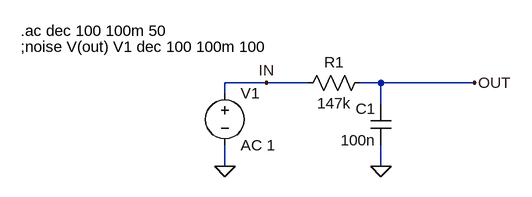
[diagram p0: schematic Draft1.asc]
Draft1.asc, the LTspice schematic file:
Version 4
SHEET 1 880 680
WIRE 32 128 -32 128
WIRE 96 128 32 128
WIRE 208 128 176 128
WIRE 352 128 208 128
WIRE -32 144 -32 128
WIRE 208 160 208 128
WIRE -32 256 -32 224
WIRE 208 256 208 224
FLAG 208 256 0
FLAG -32 256 0
FLAG 352 128 OUT
FLAG 32 128 IN
SYMBOL res 192 112 R90
WINDOW 0 0 56 VBottom 2
WINDOW 3 32 56 VTop 2
SYMATTR InstName R1
SYMATTR Value 147k
SYMBOL cap 224 224 R180
WINDOW 0 24 56 Left 2
WINDOW 3 24 8 Left 2
SYMATTR InstName C1
SYMATTR Value 100n
SYMBOL voltage -32 128 R0
WINDOW 123 0 0 Left 0
WINDOW 39 0 0 Left 0
SYMATTR InstName V1
SYMATTR Value AC 1
TEXT -346 48 Left 2 !.ac dec 100 100m 50
TEXT -346 72 Left 2 !;noise V(out) V1 dec 100 100m 100

The netlist it stands for:
* Draft1.asc
R1 OUT IN 147k
C1 0 OUT 100n
V1 IN 0 AC 1
.ac dec 100 100m 50
;noise V(out) V1 dec 100 100m 100
.backanno
.end

* Results of the author's LTspice run, read from the files saved beside the schematic
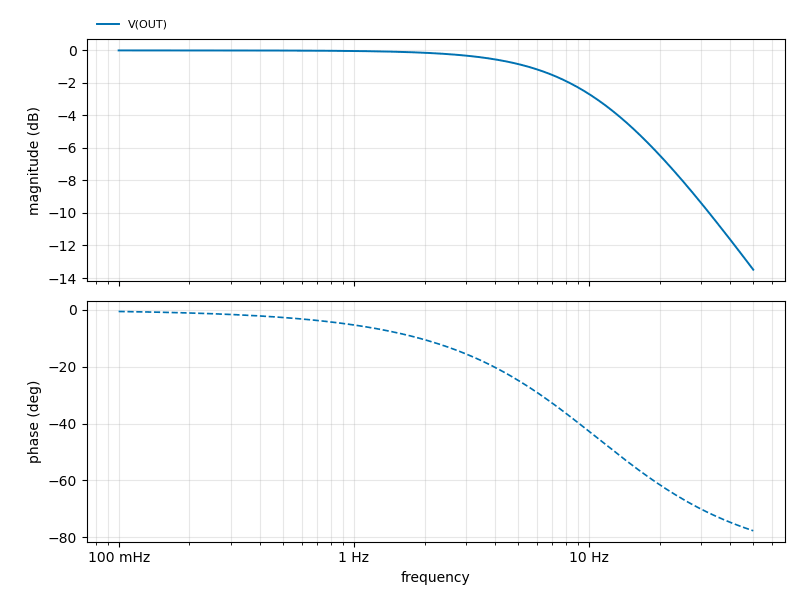
[diagram p1: AC Analysis of Draft1.asc, plotted from the saved traces]
* AC Analysis, 1 run:
*   V(OUT): -0.00 dB at 100 mHz, -13.49 dB at 50 Hz, peak -0.00 dB at 100 mHz, 3 dB below the peak at 10.83 Hz